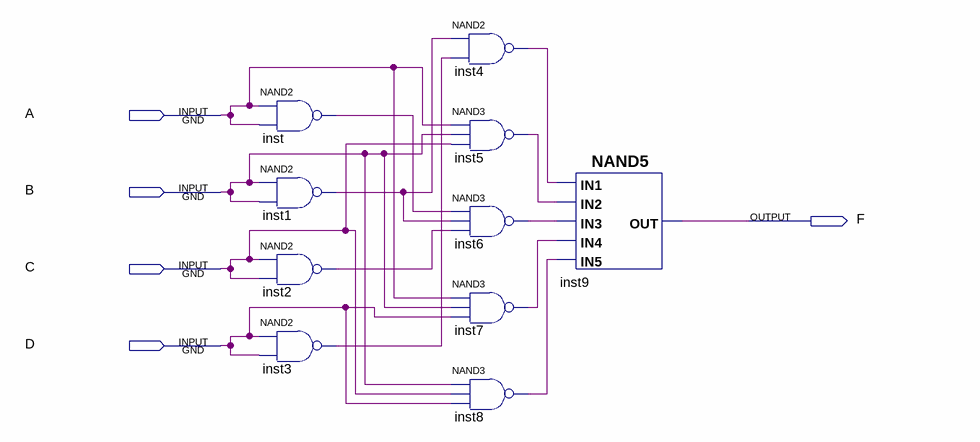
[diagram p0: schematic sheet]
// Quartus schematic gas1_3.bdf as structural Verilog: 10 symbols, 5 pins
module gas1_3 (
  input  A,
  input  B,
  input  C,
  input  D,
  output F
);

  wire inst1_out, inst2_out, inst3_out, inst4_out, inst5_out, inst6_out, inst7_out, inst8_out, inst_out;

  nand inst (inst_out, A, A);
  nand inst1 (inst1_out, B, B);
  nand inst2 (inst2_out, C, C);
  nand inst3 (inst3_out, D, D);
  nand inst4 (inst4_out, inst1_out, inst3_out);
  nand inst5 (inst5_out, A, B, C);
  nand inst6 (inst6_out, inst_out, inst1_out, inst2_out);
  nand inst7 (inst7_out, A, B, D);
  nand inst8 (inst8_out, B, C, D);
  nand inst9 (F, inst4_out, inst5_out, inst6_out, inst7_out, inst8_out);
endmodule
